# EAGLE design div_mod (EAGLE 7.7.0)
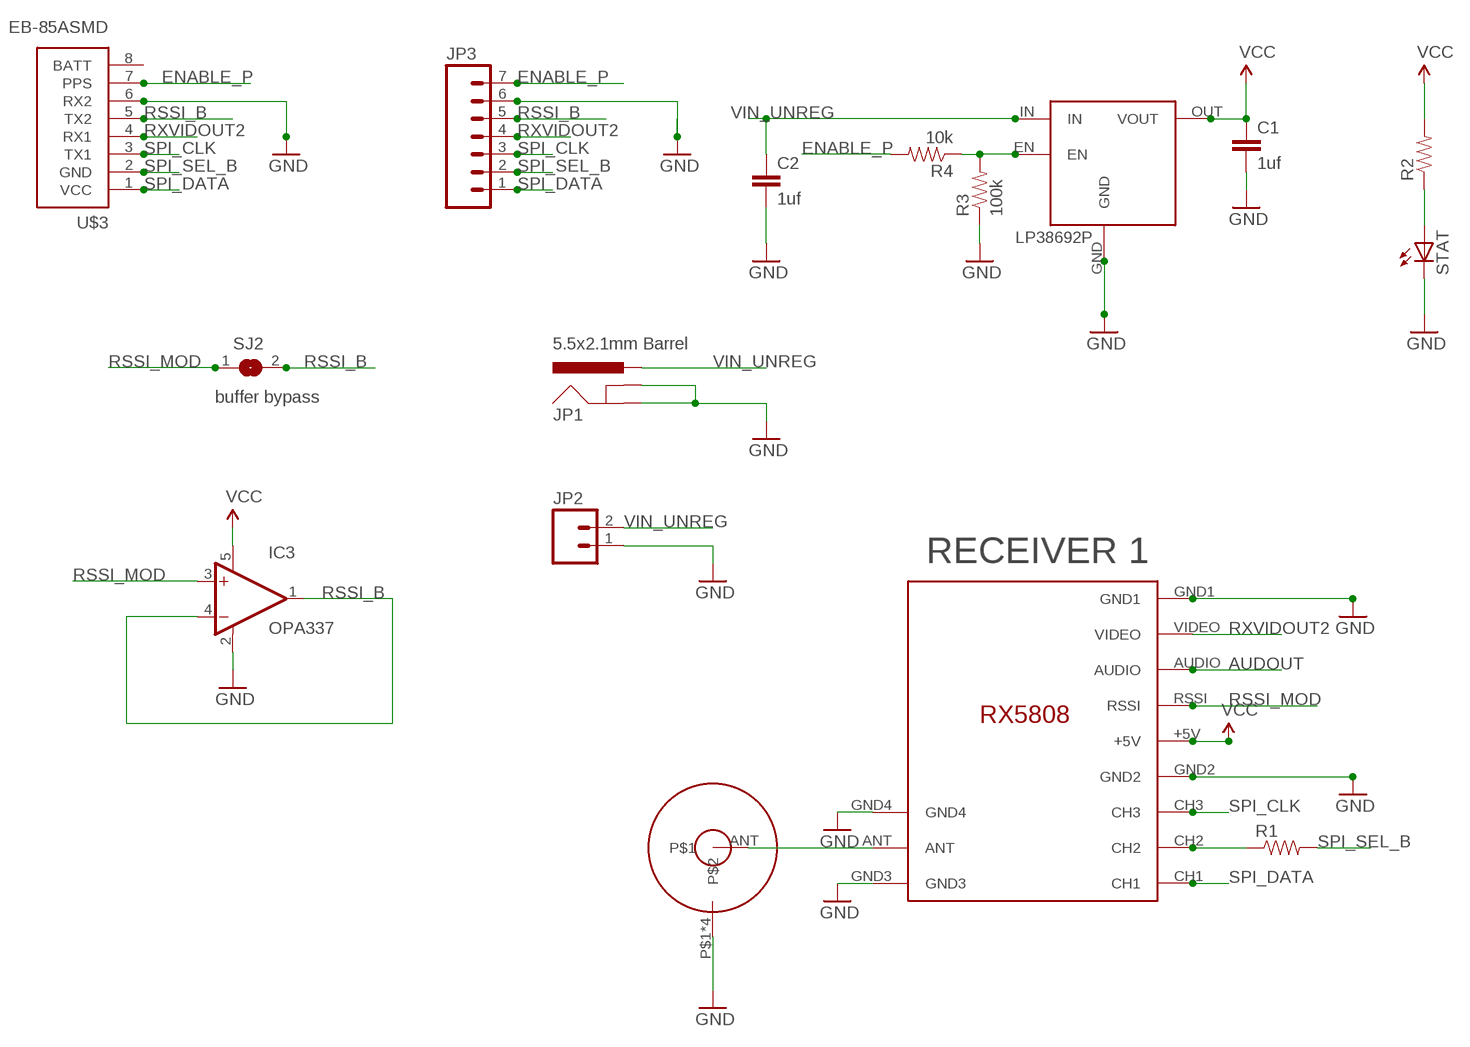
[diagram p0: schematic, sheet 1]

## Parts
C1  1uf  CAP0805  [0805]
C2  1uf  CAP0805  [0805]
IC3  OPA336N  [SOT23-5]
JP1  5.5x2.1mm Barrel  POWER_JACKSMD  [POWER_JACK_SMD]
JP2  M02PTH  [1X02]
JP3  M07  [1X07]
R1  RESISTOR0805-RES  [0805]
R2  RESISTOR0805-RES  [0805]
R3  100k  RESISTOR0805-RES  [0805]
R4  10k  RESISTOR0805-RES  [0805]
RECEIVER_A  RX5808_A  RX5808  [RX5808]
SJ2  SJ  [SJ]
STAT  LEDCHIP-LED0805  [CHIP-LED0805]
U$1  SMA_ANTENNA  [SMA_CONNECTOR]
U$3  EB-85ASMD  [EB-85A]
V1  LP38692P  [TO252-51]

## Nets
5V: C1.1 IC3.5(V+) R2.2 RECEIVER_A.+5V V1.OUT(VOUT) ; supply symbol labelled VCC
AUDOUT: RECEIVER_A.AUDIO
ENABLE: R3.2 R4.1 V1.EN
ENABLE_P: JP3.7 R4.2 U$3.7(PPS)
GND: C1.2 C2.2 IC3.2(V-) JP1.GND(GNDBREAK) JP1.P$4(GND) JP2.1 JP3.6 R3.1 RECEIVER_A.GND1 RECEIVER_A.GND2 RECEIVER_A.GND3 RECEIVER_A.GND4 STAT.C U$1.P$1 U$1.P$2 U$1.P$3 U$1.P$4 U$3.6(RX2) V1.GND
N$1: R1.1 RECEIVER_A.CH2
N$2: R2.1 STAT.A
N$5: RECEIVER_A.ANT U$1.ANT
RSSI_B: IC3.1(OUT) IC3.4(-IN) JP3.5 SJ2.2 U$3.5(TX2)
RSSI_MOD: IC3.3(+IN) RECEIVER_A.RSSI SJ2.1
RXVIDOUT2: JP3.4 RECEIVER_A.VIDEO U$3.4(RX1)
SPI_CLK: JP3.3 RECEIVER_A.CH3 U$3.3(TX1)
SPI_DATA: JP3.1 RECEIVER_A.CH1 U$3.1(VCC)
SPI_SEL_B: JP3.2 R1.2 U$3.2(GND)
VIN_UNREG: C2.1 JP1.VIN0(PWR) JP2.2 V1.IN

## Notes on the sheet
- buffer bypass
- RECEIVER 1
- OPA337

## Power pins joined to a net without a drawn wire
BATT: U$3.8(BATT)

## Library data of the parts
C1 C2 = SparkFun-Capacitors:CAP: Capacitor Standard 0603 ceramic capacitor, and 0.1" leaded capacitor.
IC3 = burr-brown:OPA336: CMOS Operational Amplifiers Single-Supply, MicroPower, MicroAmplifier(TM) Series; MPN: OPA336NA; OC_FARNELL: 1212297; OC_NEWARK: 01M8405
JP1 = SparkFun-Connectors:POWER_JACK: Power Jack This is the standard 5.5mm barrel jack for power. The PTH is the most common, proven, reliable, footprint. The Slot footprint only works if the mill layer is transmitted to the PCB fab house so be warned. Mating wall wart : TOL-00298 (and others); PROD_ID: CONN-08106; SF_ID: PRT-12748
JP2 = SparkFun-Connectors:M02: Standard 2-pin 0.1" header. Use with - straight break away headers ( PRT-00116) - right angle break away headers (PRT-00553) - swiss pins (PRT-00743) - machine pins (PRT-00117) - female headers (PRT-00115) Molex polarized connector foot print use with: PRT-08233 with associated crimp pins and housings. 2.54_SCREWTERM for use with PRT-10571. 3.5mm Screw Terminal footprints for PRT-08084 5mm Screw Terminal footprints for use with PRT-08432
JP3 = SparkFun-Connectors:M07: Header 7 Standard 7-pin 0.1" header. Use with straight break away headers (SKU : PRT-00116), right angle break away headers (PRT-00553), swiss pins (PRT-00743), machine pins (PRT-00117), and female headers (PRT-00115). NOTES ON THE VARIANTS LOCK and LOCK_LONGPADS... This footprint was designed to help hold the alignment of a through-hole component (i.e. 7-pin header) while soldering it into place. You may notice that each hole has been shifted either up or down by 0.005 of an inch from it's more standard position (which is usually a perfectly straight line). This slight alteration caused the pins (the squares in the middle) to touch the edges of the holes. Because they are alternating, it causes a "brace" to hold the header in place. 0.005 has proven to be the perfect amount of "off-center" position when using our standard breakaway headers. Although looks a little odd when you look at the bare footprint, once you have a header in there, the alteration is very hard to notice. Also, if you push a header all the way into place, it is covered up entirely on the bottom side. This idea of altering the position of holes to aid alignment will be further integrated into the Sparkfun Library for other footprints. It can help hold any component with 3 or more connection pins.
R1-R4 = SparkFun-Passives:RESISTOR: Resistor Basic schematic elements and footprints for 0603, 1206, and PTH resistors.
RECEIVER_A = 1customstuff:RX5808
SJ2 = jumper:SJ: SMD solder JUMPER
STAT = led:LED: LED OSRAM: - CHIPLED LG R971, LG N971, LY N971, LG Q971, LY Q971, LO R971, LY R971 LH N974, LH R974 LS Q976, LO Q976, LY Q976 LO Q996 - Hyper CHIPLED LW Q18S LB Q993, LB Q99A, LB R99A - SideLED LS A670, LO A670, LY A670, LG A670, LP A670 LB A673, LV A673, LT A673, LW A673 LH A674 LY A675 LS A676, LA A676, LO A676, LY A676, LW A676 LS A679, LY A679, LG A679 - Hyper Micro SIDELED® LS Y876, LA Y876, LO Y876, LY Y876 LT Y87S - SmartLED LW L88C, LW L88S LB L89C, LB L89S, LG L890 LS L89K, LO L89K, LY L89K LS L896, LA L896, LO L896, LY L896 - TOPLED LS T670, LO T670, LY T670, LG T670, LP T670 LSG T670, LSP T670, LSY T670, LOP T670, LYG T670 LG T671, LOG T671, LSG T671 LB T673, LV T673, LT T673, LW T673 LH T674 LS T676, LA T676, LO T676, LY T676, LB T676, LH T676, LSB T676, LW T676 LB T67C, LV T67C, LT T67C, LS T67K, LO T67K, LY T67K, LW E67C LS E67B, LA E67B, LO E67B, LY E67B, LB E67C, LV E67C, LT E67C LW T67C LS T679, LY T679, LG T679 LS T770, LO T770, LY T770, LG T770, LP T770 LB T773, LV T773, LT T773, LW T773 LH T774 LS E675, LA E675, LY E675, LS T675 LS T776, LA T776, LO T776, LY T776, LB T776 LHGB T686 LT T68C, LB T68C - Hyper Mini TOPLED® LB M676 - Mini TOPLED Santana® LG M470 LS M47K, LO M47K, LY M47K Source: http://www.osram.convergy.de LUXEON: - LUMILED® LXK2-PW12-R00, LXK2-PW12-S00, LXK2-PW14-U00, LXK2-PW14-V00 LXK2-PM12-R00, LXK2-PM12-S00, LXK2-PM14-U00 LXK2-PE12-Q00, LXK2-PE12-R00, LXK2-PE12-S00, LXK2-PE14-T00, LXK2-PE14-U00 LXK2-PB12-K00, LXK2-PB12-L00, LXK2-PB12-M00, LXK2-PB14-N00, LXK2-PB14-P00, LXK2-PB14-Q00 LXK2-PR12-L00, LXK2-PR12-M00, LXK2-PR14-Q00, LXK2-PR14-R00 LXK2-PD12-Q00, LXK2-PD12-R00, LXK2-PD12-S00 LXK2-PH12-R00, LXK2-PH12-S00 LXK2-PL12-P00, LXK2-PL12-Q00, LXK2-PL12-R00 Source: www.luxeon.com KINGBRIGHT: KA-3528ASYC Source: www.kingbright.com
U$1 = #fpv:SMA_ANTENNA
U$3 = SparkFun-Connectors:EB-85A: EB-85A Connector Proven layout and schematic for ETek 5Hz GPS receiver connector. Spark Fun Electronics SKU : GPS-08297
V1 = lp38692:LP38692: Infineon BTS443 Profet Smart Highside Power Switch Author: Dipl.-Ing. FH Rainer Bayer, Hochschule Heilbronn HHN rainer.bayer@hs-heilbronn.de http://mitarbeiter.hs-heilbronn.de/~rbayer/

## Net classes
0 default: width 0.254 mm, clearance 0.254 mm
1 vcc: width 0.254 mm
2 gnd: width 0.305 mm, drill 0.559 mm, clearance 0.254 mm
3 usbvcc: width 0.508 mm, drill 0.61 mm, clearance 0.254 mm

## Board
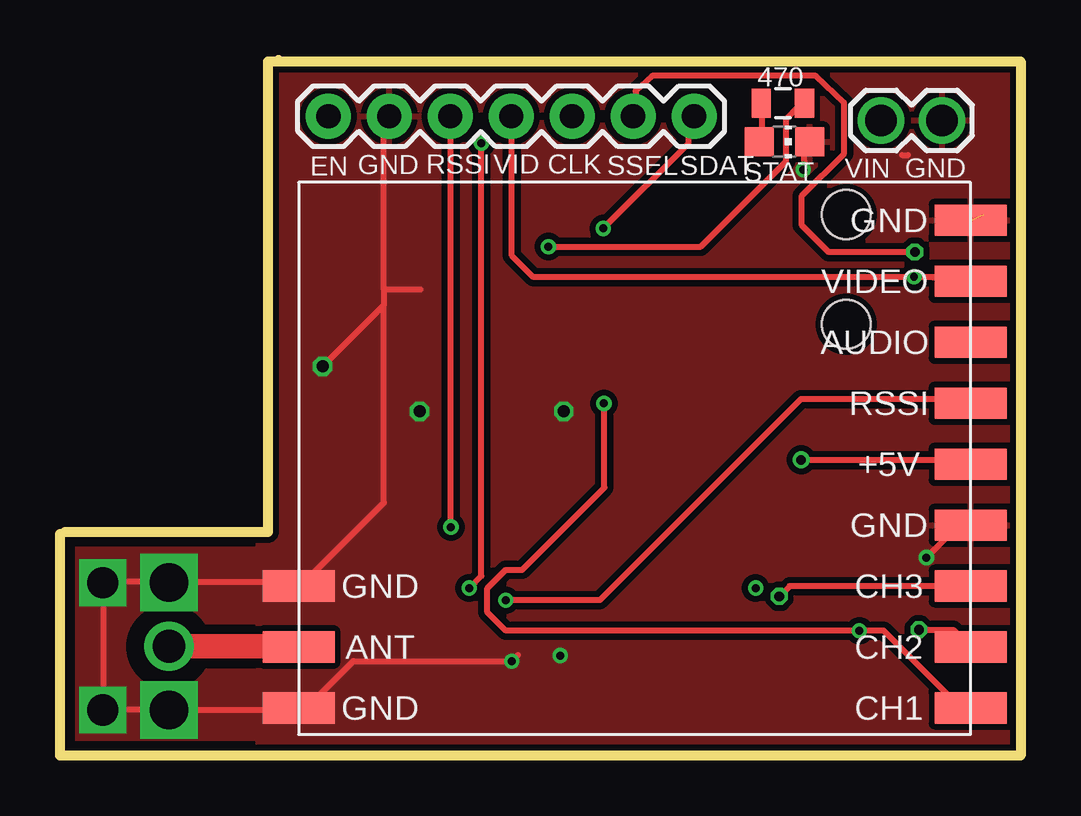
[diagram p1: board, top side]
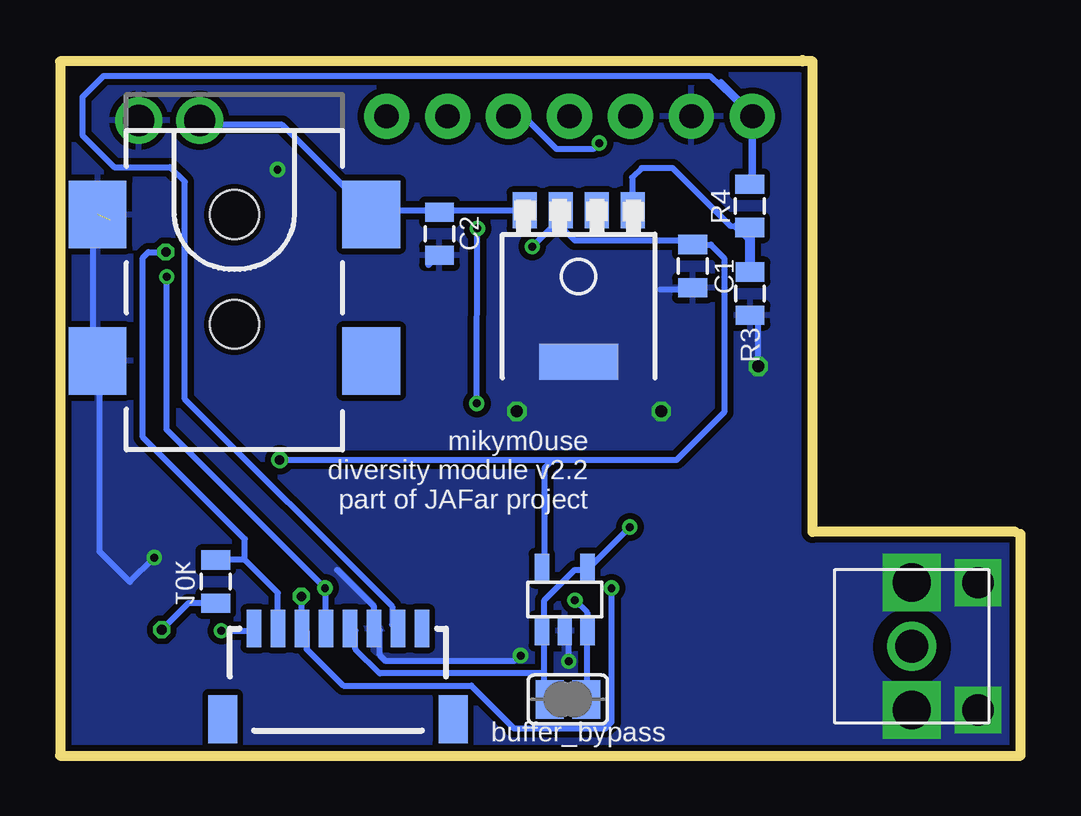
[diagram p2: board, bottom side, seen from below]

Size 40.03 x 28.98 mm. Coordinates in mm from the lower left corner, seen from the top.
Outline: 0,9.22 0,0 40.03,0 40.03,28.92 9.1,28.92
Outline: 9.1,28.98 9.1,28.92
Outline: 0.21,9.32 8.67,9.32 8.67,28.92 9.1,28.92
Copper layers (1*16): Top 0.035mm / dielectric 1.5mm / Bottom 0.035mm
Design rules "dirt_cheap_dirty_boards.v1": minimum track width 5mil, minimum drill 12mil, track to track 5mil, track to pad 5mil, pad to pad 5mil, via to via 5mil, smd to smd 0mil, copper to edge 10mil, drill to drill 10mil, minimum pad ring 10mil, minimum via ring 6mil, stop-mask expansion 2mil, vias tented up to drill 25mil, thermal gap 10mil

### Footprints (pad centres in the part's own frame; a part is rotated, then mirrored left to right if it is on the bottom)
0805 = smd 0.8 x 1.2: 1 -0.9,0; 2 0.9,0
SOT23-5 = smd 0.6 x 1.2: 1 -0.95,-1.306; 2 0,-1.306; 3 0.95,-1.306; 4 0.95,1.306; 5 -0.95,1.306
POWER_JACK_SMD = smd 2.8 x 2.4: GND 0,-5.7; P$4 6.1,-5.7; VIN0 0,5.7; VIN1 6.1,5.7 | hole 2.032: 0,0; 4.572,0
1X02 = drill 1.3: 1 0,0; 2 2.54,0
1X07 = drill 1.016 pad 1.88: 1 0,0; 2 2.54,0; 3 5.08,0; 4 7.62,0; 5 10.16,0; 6 12.7,0; 7 15.24,0
RX5808 = smd 3 x 1.3: +5V 28,11.26; ANT 0,3.64; AUDIO 28,16.34; CH1 28,1.1; CH2 28,3.64; CH3 28,6.18; GND1 28,21.42; GND2 28,8.72; GND3 0,1.1; GND4 0,6.18; RSSI 28,13.8; VIDEO 28,18.88
SJ = smd 1.168 x 1.6: 1 -0.762,0; 2 0.762,0
CHIP-LED0805 = smd 1.2 x 1.2: A 0,-1.05; C 0,1.05
SMA_CONNECTOR = drill 1.37: ANT -0.02,-0.017 | drill 1.3 square: P$1 -2.67,2.743; P$2 2.64,2.743 | drill 1.6 square: P$3 -2.67,-0.017; P$4 2.64,-0.017
EB-85A = smd 0.6 x 1.55: 1 0,0; 2 1,0; 3 2,0; 4 3,0; 5 4,0; 6 5,0; 7 6,0; 8 7,0 | smd 1.2 x 2: P$1 -1.3,-3.775; P$2 8.3,-3.775
TO252-51 = smd 1 x 1.5: EN 0,0; IN 4.5,0; NC 1.5,0; OUT 3,0 | smd 3.3 x 1.5: GND 2.25,6.3

### Placement (x,y rotation side)
C1  13.67,20.39 270 bottom
C2  24.22,21.74 270 bottom
IC3  19,6.5 0 bottom
JP1  32.76,22.54 270 bottom
JP2  36.75,26.46 180 top
JP3  26.42,26.64 180 top
R1  33.54,7.25 90 bottom
R2  30.12,27.18 0 top
R3  11.28,19.25 90 bottom
R4  11.29,22.9 90 bottom
RECEIVER_A  9.94,0.88 0 top
SJ2  18.87,2.34 180 bottom
STAT  30.19,25.57 270 top
U$1  4.52,4.53 270 bottom
U$3  31.95,5.29 0 bottom
V1  16.17,22.71 180 bottom

### Tracks (layer width: path | path; a pad name or v marks a point on that pad's centre or on a via)
5V  (via drill 0.33, 0.4)
  Top 0.254: v20.35,21.2 26.7,21.2 30.26,24.76 30.26,26.54 30.77,27.04 31.02,27.04 R2.2 | RECEIVER_A.+5V 37.88,12.31 v30.89,12.31 v30.88,12.32
  Bottom 0.254: 19.34,22.22 19.08,22.47 V1.OUT 19.34,22.22 | 19.34,22.22 v20.35,21.2 | IC3.5 19.84,7.99 19.84,11.97 19.49,12.32 | 19.34,22.22 18.57,21.46 13.75,21.46 C1.1 12.9,21.29 12.9,21.26 12.36,20.72 12.36,14.3 14.34,12.32 19.49,12.32 | v30.88,12.32 19.49,12.32
ENABLE
  Bottom 0.254: R4.1 11.8,22.04 12.08,22.06 14.5,24.48 15.8,24.48 16.19,24.09 16.19,22.73 V1.EN
  Bottom 0.406: R3.2 11.28,21.52 11.8,22.04
ENABLE_P
  Bottom 0.254: 12.48,28.06 11.21,26.79 JP3.7 12.96,28.32 38.21,28.32 39.1,27.43 39.1,25.85 37.77,24.52 35.45,24.52 34.83,23.9 34.83,14.85 26.19,6.22 26.19,5.45 U$3.7
  Bottom 0.305: JP3.7 11.18,24.24 R4.2
  Bottom 0.406: R4.2
GND  (via drill 0.33, 0.5)  (1 unrouted)
  Top 0.254: 1.81,1.9 4.35,1.9 U$1.P$4 4.6,1.9 9.94,1.9 RECEIVER_A.GND3 10.19,1.9 12.22,3.93 v18.83,3.93 19.08,4.18 | 1.81,1.9 1.81,6.98 U$1.P$1 1.81,7.23 4.35,7.23 U$1.P$3 4.6,7.23 9.94,7.23 RECEIVER_A.GND4 10.19,7.23 13.49,10.53 13.49,18.76 | 1.81,1.9 U$1.P$2 | 31.27,25.52 STAT.C 31.02,25.52 31.02,24.76 | 36.35,26.28 JP2.1 | 35.08,25.01 35.34,25.01 | 37.88,22.47 RECEIVER_A.GND1 | v36.1,8.25 37.37,9.52 37.88,9.52 RECEIVER_A.GND2 | 13.49,19.42 13.49,26.54 JP3.6 | 13.49,19.42 15.02,19.42 | 13.49,19.42 13.49,18.76 | 13.49,18.76 v10.94,16.21
  Bottom 0.254: 4.6,7.23 U$1.P$3 | 15.02,19.42 13.75,19.42 C1.2 | 18.32,16.63 V1.GND 18.57,16.63 | 24.16,20.69 C2.2 24.42,20.69 24.67,20.44 | 28.48,7.74 26.96,6.22 26.96,5.45 U$3.6 26.7,5.2 26.7,4.18 26.45,3.93 21.11,3.93 | JP1.GND 38.64,22.47 38.64,16.63 JP1.P$4 38.39,16.38 38.39,8.5 37.12,7.23 v36.1,8.25 | v18.83,3.93 18.83,4.95 IC3.2 | v10.94,16.21 10.94,18.33 R3.1
  other vias: 14.98,14.34 20.99,14.34 30.97,24.41 20.84,4.16
  pour Top (isolate 0.254): 8.25,0.01 40,0.12 40,29.07 8.25,28.96
  pour Bottom (isolate 0.254): 0,0.04 40,0.12 40,28.12 8.63,28.56 8.45,28.03 8.53,9.02 0,9.1 -0.09,8.42
  pour Top (isolate 0.406): -2,0.12 8.81,0.12 8.81,10.23 -2,10.23
N$1  (via drill 0.4)
  Top 0.254: 37.37,4.69 37.88,4.69 RECEIVER_A.CH2 37.22,5.24 v35.79,5.24
  Bottom 0.254: R1.1 34.68,6.35 v35.79,5.24
N$2
  Top 0.254: STAT.A 29.24,25.77 29.24,27.04 R2.1
N$5
  Top 1.016: U$1.ANT 9.9,4.55 RECEIVER_A.ANT
RSSI_B  (via drill 0.33)
  Top 0.254: v16.29,9.52 16.29,26.54 JP3.5
  Bottom 0.254: 19.84,3.42 19.84,2.41 SJ2.2 | 19.84,3.42 19.84,4.95 IC3.1 19.84,5.2 19.84,6.47 18.57,7.74 18.07,7.74 IC3.4 17.81,7.99 v16.29,9.52 | 19.84,3.42 26.7,3.42 27.72,4.44 27.72,5.2 U$3.5
RSSI_MOD  (via drill 0.33)
  Top 0.254: v18.57,6.47 22.49,6.47 30.87,14.85 37.88,14.85 RECEIVER_A.RSSI
  Bottom 0.254: SJ2.1 18.07,2.41 18.07,4.95 IC3.3 18.07,5.2 18.07,5.96 v18.57,6.47
RXVIDOUT2  (via drill 0.33)
  Top 0.254: 18.83,26.54 JP3.4 18.83,26.61 18.83,20.83 19.73,19.93 37.88,19.93 RECEIVER_A.VIDEO 35.69,19.97 v35.58,19.95
  Bottom 0.254: U$3.4 28.99,5.45 v28.99,6.98 35.59,13.58 35.59,19.81 v35.58,19.95
SPI_CLK  (via drill 0.33, 0.4)
  Top 0.254: v17.56,25.52 17.56,7.49 v17.05,6.98 | RECEIVER_A.CH3 30.4,7.06 v29.97,6.63
  Bottom 0.254: v17.56,25.52 17.81,25.27 19.34,25.27 20.61,26.54 21.11,26.54 JP3.3 | v17.05,6.98 17.05,1.39 17.3,1.14 21.11,1.14 22.89,2.91 28.23,2.91 29.75,4.44 29.75,5.2 U$3.3 29.97,5.31 v29.97,6.63
SPI_DATA  (via drill 0.33)
  Top 0.254: RECEIVER_A.CH1 37.88,2.15 37.37,2.15 34.32,5.2 v33.31,5.2 18.57,5.2 17.81,5.96 17.81,6.98 18.57,7.74 19.26,7.74 22.68,11.16 22.68,14.65 v22.66,14.67 | v22.64,21.96 26.19,25.52 26.19,26.54 JP3.1
  Bottom 0.254: v33.31,5.2 32.04,5.2 U$3.1 | v22.66,14.67 v22.64,21.96
SPI_SEL_B  (via drill 0.4)
  Top 0.254: JP3.2 23.98,26.74 23.98,27.69 24.67,28.32 31.49,28.32 32.67,27.2 32.67,25.08 30.91,23.32 30.91,22.1 32.04,20.97 v35.62,20.98
  Bottom 0.254: U$3.2 30.95,6.78 32.33,8.16 | 32.33,8.16 R1.2 | 32.33,8.16 32.33,9.02 36.58,13.27 36.58,20.75 36.35,20.98 v35.62,20.98
VIN_UNREG
  Bottom 0.254: V1.IN 20.86,22.73 24.16,22.73 C2.1 24.42,22.73 26.96,22.73 JP1.VIN0 27.21,22.73 30.77,26.28 33.56,26.28 JP2.2

### Text on the board
tNames: 470 | EN | GND | GND | RSSI | VID | CLK | SSEL | SDAT | VIN
bNames: mikym0use / diversity module v2.2 / part of JAFar project | 10k | buffer_bypass
bValues: OPA337